# EAGLE schematic powerDistribution (EAGLE 9.5.2)
DATE: Spring'20; REVISION: 1; SCH_DESC: Measures current; Outputs to Teensy or USB; TEAM: RoboWrestling; TITLE: Current Sensing Board
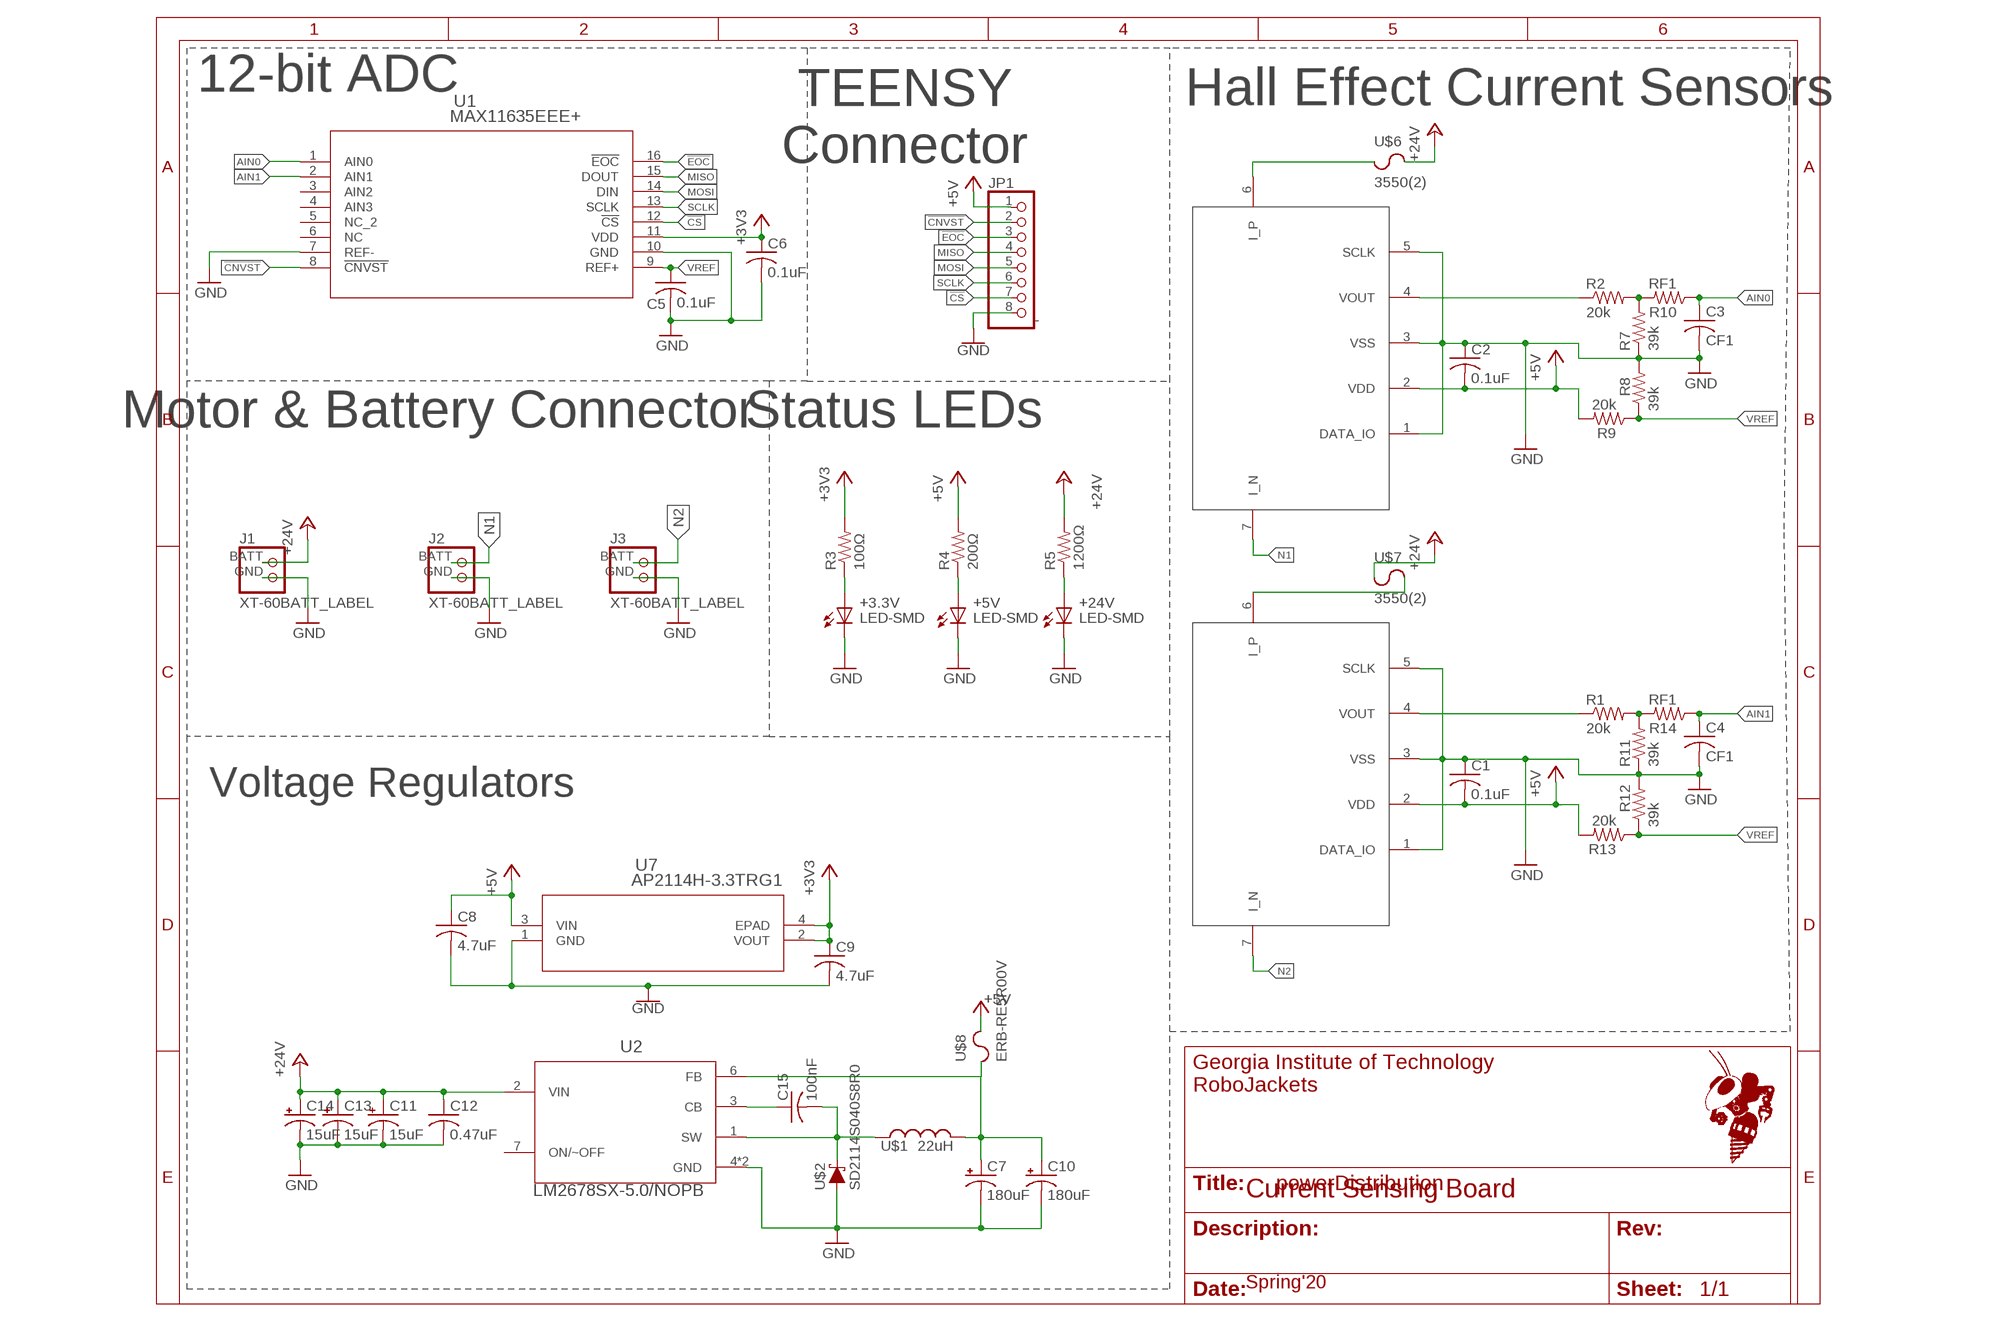
[diagram p0: schematic, sheet 1]

## Parts
+3.3V  LED-SMD  [CHIP-LED0603]
+5V  LED-SMD  [CHIP-LED0603]
+24V  LED-SMD  [CHIP-LED0603]
C1  0.1uF  C-USC0603  [C0603]
C2  0.1uF  C-USC0603  [C0603]
C3  CF1  C-USC0603  [C0603]
C4  CF1  C-USC0603  [C0603]
C5  0.1uF  C-USC0603  [C0603]
C6  0.1uF  C-USC0603  [C0603]
C7  180uF  860010373009  [860010373009]
C8  4.7uF  C-USC0603  [C0603]
C9  4.7uF  C-USC0603  [C0603]
C10  180uF  860010373009  [860010373009]
C11  15uF  TR3E156M050C0300  [TR3E156M050C0300]
C12  0.47uF  C-USC0603  [C0603]
C13  15uF  TR3E156M050C0300  [TR3E156M050C0300]
C14  15uF  TR3E156M050C0300  [TR3E156M050C0300]
C15  100nF  C-USC0603  [C0603]
J1  XT-60BATT_LABEL  [XT-60]
J2  XT-60BATT_LABEL  [XT-60]
J3  XT-60BATT_LABEL  [XT-60]
JP1  PINHD-1X8/90  [1X08/90]
R1  20k  R-US_R0603  [R0603]
R2  20k  R-US_R0603  [R0603]
R3  100Ω  R-US_R0603  [R0603]
R4  200Ω  R-US_R0603  [R0603]
R5  1200Ω  R-US_R0603  [R0603]
R7  39k  R-US_R0603  [R0603]
R8  39k  R-US_R0603  [R0603]
R9  20k  R-US_R0603  [R0603]
R10  RF1  R-US_R0603  [R0603]
R11  39k  R-US_R0603  [R0603]
R12  39k  R-US_R0603  [R0603]
R13  20k  R-US_R0603  [R0603]
R14  RF1  R-US_R0603  [R0603]
U1  MAX11635EEE+  [21-0055H_16_MXM]
U2  LM2678SX-5.0/NOPB  [TS7B]
U7  AP2114H-3.3TRG1  [SOT-223]
U$1  22uH  7447709220  [INDUCTOR22]
U$2  SD2114S040S8R0  [SD2114S040S8R0]
U$4  CQ2065  [CQ2065]
U$5  CQ2065  [CQ2065]
U$6  3550(2)  [3550]
U$7  3550(2)  [3550]
U$8  ERB-RE5R00V  [ERB-RE5R00V]

## Nets
!CNVST!: JP1.2 U1.8(!CNVST)
!CS!: JP1.7 U1.12(!CS)
!EOC!: JP1.3 U1.16(!EOC)
+3V3: C6.1 C9.1 R3.2 U1.11(VDD) U7.2(VOUT) U7.4(EPAD)
+5V: C1.2 C2.2 C8.1 JP1.1 R4.2 R9.2 R13.2 U7.3(VIN) U$4.2(VDD) U$5.2(VDD) U$8.P$2
+24V: C11.1(+) C12.1 C13.1(+) C14.1(+) J1.BATT R5.2 U2.2(VIN) U$6.P$2 U$6.P$4 U$7.P$1 U$7.P$3
AIN0: C3.1 R10.1 U1.1(AIN0)
AIN1: C4.1 R14.1 U1.2(AIN1)
GND: +3.3V.C(K) +5V.C(K) +24V.C(K) C1.1 C2.1 C3.2 C4.2 C5.2 C6.2 C7.2(-) C8.2 C9.2 C10.2(-) C11.2(-) C12.2 C13.2(-) C14.2(-) J1.GND J2.GND J3.GND JP1.8 R7.1 R8.2 R11.1 R12.2 U1.7(REF-) U1.10(GND) U2.4(GND) U2.8(GND) U7.1(GND) U$2.1(A) U$4.1(DATA_IO) U$4.3(VSS) U$4.5(SCLK) U$5.1(DATA_IO) U$5.3(VSS) U$5.5(SCLK)
MISO: JP1.4 U1.15(DOUT)
MOSI: JP1.5 U1.14(DIN)
N1: J2.BATT U$4.7(I_N)
N2: J3.BATT U$5.7(I_N)
N$1: R1.1 U$5.4(VOUT)
N$2: R2.2 R7.2 R10.2
N$3: R2.1 U$4.4(VOUT)
N$4: R1.2 R11.2 R14.2
N$5: +3.3V.A R3.1
N$6: C15.2 U2.1(SW) U$1.P$1 U$2.2(C)
N$7: C15.1 U2.3(CB)
N$8: +5V.A R4.1
N$9: +24V.A R5.1
N$10: C7.1(+) C10.1(+) U2.6(FB) U$1.P$2 U$8.P$1
P1: U$4.6(I_P) U$6.P$1 U$6.P$3
P2: U$5.6(I_P) U$7.P$2 U$7.P$4
SCLK: JP1.6 U1.13(SCLK)
VREF: C5.1 R8.1 R9.1 R12.1 R13.1 U1.9(REF+)
Unconnected: U1.3(AIN2) U1.4(AIN3) U1.5(NC_2) U1.6(NC) U2.7(ON/~OFF)

## Notes on the sheet
- 12-bit ADC | Hall Effect Current Sensors
- TEENSY 
  Connector
- Motor & Battery Connector | Status LEDs
- Voltage Regulators

## Library data of the parts
+3.3V +5V +24V = RoboJackets-LEDs:LED-SMD
C1-C6 C8 C9 C12 C15 = rcl:C-US: CAPACITOR, American symbol; SPICEPREFIX: C
C7 C10 = CurrentSensing:860010373009
C11 C13 C14 = CurrentSensing:TR3E156M050C0300
J1-J3 = RoboJackets-Connectors:XT-60: XT-60 Power Connector Distributor: HobbyKing <http://www.hobbyking.com/hobbyking/store/RC_PRODUCT_SEARCH.asp?strSearch=xt-60>
JP1 = pinhead:PINHD-1X8: PIN HEADER
R1-R5 R7-R14 = rcl:R-US_: RESISTOR, American symbol; SPICEPREFIX: R
U1 = CurrentSensing:MAX11635EEE+; BUILT_BY: EMA_UL_Team; MANUFACTURER_PART_NUMBER: MAX11635EEE+; SOURCELIBRARY: Maxim_2014-05-21; VENDOR: Maxim Integrated Products
U2 = CurrentSensing:LM2678SX-5.0/NOPB
U7 = Gucci_ControlBoard:AP2114H-3.3TRG1; MANUFACTURER_PART_NUMBER: AP2114H3.3TRG1; VENDOR: Diodes Inc
U$1 = CurrentSensing:7447709220
U$2 = CurrentSensing:SD2114S040S8R0
U$4 U$5 = CurrentSensing:CQ2065
U$6 U$7 = CurrentSensing:3550(2)
U$8 = CurrentSensing:ERB-RE5R00V